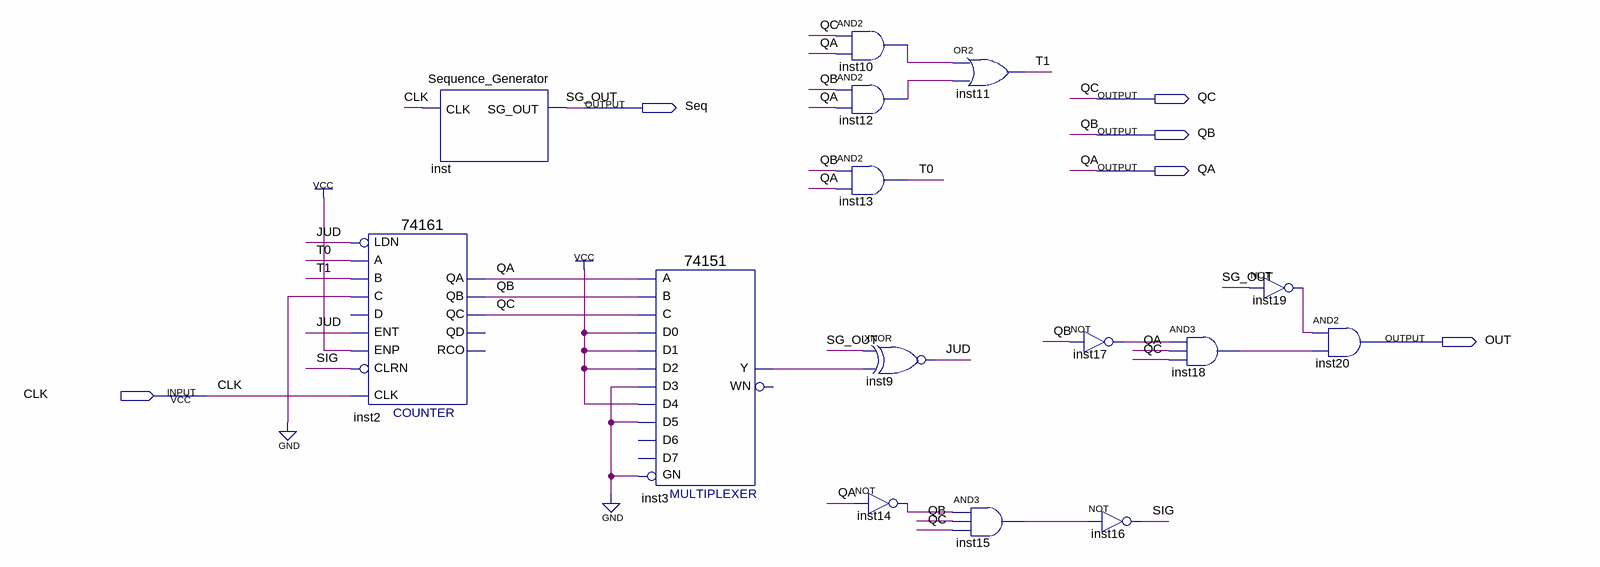
[diagram p0: schematic sheet]
// Quartus schematic Sequence_Verification.bdf as structural Verilog: 15 symbols, 6 pins
module Sequence_Verification (
  input  CLK,
  output QC,
  output Seq,
  output QB,
  output QA,
  output OUT
);

  wire inst3_y, inst10_out, inst12_out, inst14_out, inst15_out, inst17_out, inst18_out, inst19_out, JUD, SIG,
       T0, T1;

  \74161  inst2 (
    .CLRN(SIG), .CLK(CLK), .ENP(1'b1), .LDN(JUD), .A(T0), .ENT(JUD), .B(T1), .C(1'b0), .QC(QC), .QB(QB),
    .QA(QA));  // open: D, QD, RCO
  Sequence_Generator inst (.CLK(CLK), .SG_OUT(Seq));
  \74151  inst3 (
    .GN(1'b0), .C(QC), .B(QB), .A(QA), .D5(1'b0), .D0(1'b1), .D1(1'b1), .D4(1'b1), .D3(1'b0), .D2(1'b1),
    .Y(inst3_y));  // open: D6, D7, WN
  and inst10 (inst10_out, QC, QA);
  and inst12 (inst12_out, QB, QA);
  and inst13 (T0, QB, QA);
  xnor inst9 (JUD, Seq, inst3_y);
  not inst14 (inst14_out, QA);
  or inst11 (T1, inst10_out, inst12_out);
  and inst15 (inst15_out, inst14_out, QB, QC);
  not inst17 (inst17_out, QB);
  not inst16 (SIG, inst15_out);
  and inst18 (inst18_out, inst17_out, QA, QC);
  not inst19 (inst19_out, Seq);
  and inst20 (OUT, inst19_out, inst18_out);

  // Other names for the same wires on the sheet: SG_OUT = Seq
endmodule
